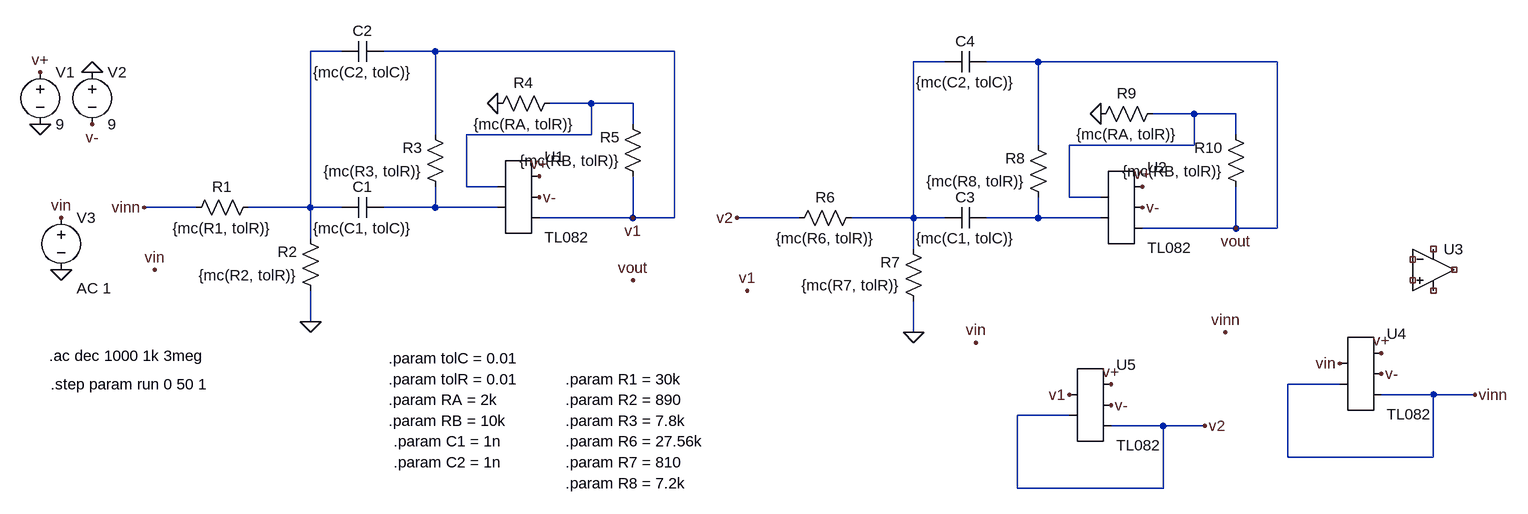
[diagram p0: schematic ej22.asc]
ej22.asc, the LTspice schematic file:
Version 4
SHEET 1 2084 680
WIRE 272 -80 224 -80
WIRE 416 -80 336 -80
WIRE 784 -80 416 -80
WIRE 1200 -64 1152 -64
WIRE 1344 -64 1264 -64
WIRE 1712 -64 1344 -64
WIRE 656 0 592 0
WIRE 720 0 656 0
WIRE 1584 16 1520 16
WIRE 1648 16 1584 16
WIRE 720 32 720 0
WIRE 416 48 416 -80
WIRE 656 48 656 0
WIRE 656 48 464 48
WIRE 1648 48 1648 16
WIRE 1344 64 1344 -64
WIRE 1584 64 1584 16
WIRE 1584 64 1392 64
WIRE 464 128 464 48
WIRE 512 128 464 128
WIRE 1392 144 1392 64
WIRE 1440 144 1392 144
WIRE 48 160 -32 160
WIRE 224 160 224 -80
WIRE 224 160 128 160
WIRE 272 160 224 160
WIRE 416 160 416 128
WIRE 416 160 336 160
WIRE 512 160 416 160
WIRE 720 176 720 112
WIRE 720 176 576 176
WIRE 784 176 784 -80
WIRE 784 176 720 176
WIRE 976 176 880 176
WIRE 1152 176 1152 -64
WIRE 1152 176 1056 176
WIRE 1200 176 1152 176
WIRE 1344 176 1344 144
WIRE 1344 176 1264 176
WIRE 1440 176 1344 176
WIRE 1648 192 1648 128
WIRE 1648 192 1504 192
WIRE 1712 192 1712 -64
WIRE 1712 192 1648 192
WIRE 224 208 224 160
WIRE 1152 224 1152 176
WIRE 224 336 224 288
WIRE 1152 352 1152 304
WIRE 1808 432 1728 432
WIRE 1952 448 1872 448
WIRE 2016 448 1952 448
WIRE 1392 480 1312 480
WIRE 1536 496 1456 496
WIRE 1600 496 1536 496
WIRE 1728 544 1728 432
WIRE 1952 544 1952 448
WIRE 1952 544 1728 544
WIRE 1312 592 1312 480
WIRE 1536 592 1536 496
WIRE 1536 592 1312 592
FLAG 224 336 0
FLAG 512 0 0
FLAG 576 112 v+
FLAG 576 144 v-
FLAG -192 -48 v+
FLAG -112 32 v-
FLAG 1152 352 0
FLAG 1440 16 0
FLAG 1504 128 v+
FLAG 1504 160 v-
FLAG 1248 368 vin
FLAG -16 256 vin
FLAG 720 272 vout
FLAG 1648 192 vout
FLAG 720 176 v1
FLAG -160 176 vin
FLAG -192 32 0
FLAG -112 -48 0
FLAG -160 256 0
FLAG 880 176 v2
FLAG 2016 448 vinn
FLAG -32 160 vinn
FLAG 1808 400 vin
FLAG 1632 352 vinn
FLAG 1392 448 v1
FLAG 1872 384 v+
FLAG 1872 416 v-
FLAG 1600 496 v2
FLAG 1456 432 v+
FLAG 1456 464 v-
FLAG 896 288 v1
SYMBOL res 144 144 R90
WINDOW 0 0 56 VBottom 2
WINDOW 3 32 56 VTop 2
SYMATTR InstName R1
SYMATTR Value {mc(R1, tolR)}
SYMBOL res 240 304 R180
WINDOW 0 36 76 Left 2
WINDOW 3 36 40 Left 2
SYMATTR InstName R2
SYMATTR Value {mc(R2, tolR)}
SYMBOL res 432 144 R180
WINDOW 0 36 76 Left 2
WINDOW 3 36 40 Left 2
SYMATTR InstName R3
SYMATTR Value {mc(R3, tolR)}
SYMBOL cap 336 144 R90
WINDOW 0 0 32 VBottom 2
WINDOW 3 32 32 VTop 2
SYMATTR InstName C1
SYMATTR Value {mc(C1, tolC)}
SYMBOL cap 336 -96 R90
WINDOW 0 0 32 VBottom 2
WINDOW 3 32 32 VTop 2
SYMATTR InstName C2
SYMATTR Value {mc(C2, tolC)}
SYMBOL res 608 -16 R90
WINDOW 0 0 56 VBottom 2
WINDOW 3 32 56 VTop 2
SYMATTR InstName R4
SYMATTR Value {mc(RA, tolR)}
SYMBOL res 736 128 R180
WINDOW 0 36 76 Left 2
WINDOW 3 36 40 Left 2
SYMATTR InstName R5
SYMATTR Value {mc(RB, tolR)}
SYMBOL AutoGenerated\\TL082 544 144 R0
SYMATTR InstName U1
SYMBOL res 1072 160 R90
WINDOW 0 0 56 VBottom 2
WINDOW 3 32 56 VTop 2
SYMATTR InstName R6
SYMATTR Value {mc(R6, tolR)}
SYMBOL res 1168 320 R180
WINDOW 0 36 76 Left 2
WINDOW 3 36 40 Left 2
SYMATTR InstName R7
SYMATTR Value {mc(R7, tolR)}
SYMBOL res 1360 160 R180
WINDOW 0 36 76 Left 2
WINDOW 3 36 40 Left 2
SYMATTR InstName R8
SYMATTR Value {mc(R8, tolR)}
SYMBOL cap 1264 160 R90
WINDOW 0 0 32 VBottom 2
WINDOW 3 32 32 VTop 2
SYMATTR InstName C3
SYMATTR Value {mc(C1, tolC)}
SYMBOL cap 1264 -80 R90
WINDOW 0 0 32 VBottom 2
WINDOW 3 32 32 VTop 2
SYMATTR InstName C4
SYMATTR Value {mc(C2, tolC)}
SYMBOL res 1536 0 R90
WINDOW 0 0 56 VBottom 2
WINDOW 3 32 56 VTop 2
SYMATTR InstName R9
SYMATTR Value {mc(RA, tolR)}
SYMBOL res 1664 144 R180
WINDOW 0 36 76 Left 2
WINDOW 3 36 40 Left 2
SYMATTR InstName R10
SYMATTR Value {mc(RB, tolR)}
SYMBOL AutoGenerated\\TL082 1472 160 R0
SYMATTR InstName U2
SYMBOL voltage -192 -64 R0
WINDOW 123 0 0 Left 0
WINDOW 39 0 0 Left 0
SYMATTR InstName V1
SYMATTR Value 9
SYMBOL voltage -112 -64 R0
WINDOW 123 0 0 Left 0
WINDOW 39 0 0 Left 0
SYMATTR InstName V2
SYMATTR Value 9
SYMBOL voltage -160 160 R0
WINDOW 123 24 124 Left 2
WINDOW 39 0 0 Left 0
SYMATTR InstName V3
SYMATTR Value ""
SYMATTR Value2 AC 1
SYMBOL Opamps\\UniversalOpamp2 1952 256 R0
SYMATTR InstName U3
SYMBOL AutoGenerated\\TL082 1840 416 R0
SYMATTR InstName U4
SYMBOL AutoGenerated\\TL082 1424 464 R0
SYMATTR InstName U5
TEXT 344 424 Left 2 !.param tolR = 0.01
TEXT 344 456 Left 2 !.param RA = 2k
TEXT 344 488 Left 2 !.param RB = 10k
TEXT 616 424 Left 2 !.param R1 = 30k
TEXT 616 456 Left 2 !.param R2 = 890
TEXT 352 520 Left 2 !.param C1 = 1n
TEXT 352 552 Left 2 !.param C2 = 1n
TEXT 616 488 Left 2 !.param R3 = 7.8k
TEXT 616 520 Left 2 !.param R6 = 27.56k
TEXT 616 552 Left 2 !.param R7 = 810
TEXT 616 584 Left 2 !.param R8 = 7.2k
TEXT -178 388 Left 2 !.ac dec 1000 1k 3meg
TEXT 344 392 Left 2 !.param tolC = 0.01
TEXT -176 432 Left 2 !.step param run 0 50 1

The netlist it stands for:
* ej22.asc
R1 N001 vinn {mc(R1, tolR)}
R2 0 N001 {mc(R2, tolR)}
R3 N005 v1 {mc(R3, tolR)}
C1 N005 N001 {mc(C1, tolC)}
C2 v1 N001 {mc(C2, tolC)}
R4 N003 0 {mc(RA, tolR)}
R5 v1 N003 {mc(RB, tolR)}
* U1: TL082 (symbol AutoGenerated\TL082 not available, pins judged from their places): pin1=N003 pin2=N005 pin3=v+ pin4=v- pin5=v1
R6 N002 v2 {mc(R6, tolR)}
R7 0 N002 {mc(R7, tolR)}
R8 N006 vout {mc(R8, tolR)}
C3 N006 N002 {mc(C1, tolC)}
C4 vout N002 {mc(C2, tolC)}
R9 N004 0 {mc(RA, tolR)}
R10 vout N004 {mc(RB, tolR)}
* U2: TL082 (symbol AutoGenerated\TL082 not available, pins judged from their places): pin1=N004 pin2=N006 pin3=v+ pin4=v- pin5=vout
V1 v+ 0 9
V2 0 v- 9
V3 vin 0 AC 1
XU3 NC_01 NC_02 NC_03 NC_04 NC_05 level.2 Avol=1Meg GBW=10Meg Slew=10Meg ilimit=25m rail=0 Vos=0 phimargin=45 en=0 enk=0 in=0 ink=0 Rin=500Meg  ; pins IN+ IN- V+ V- OUT
* U4: TL082 (symbol AutoGenerated\TL082 not available, pins judged from their places): pin1=vin pin2=vinn pin3=v+ pin4=v- pin5=vinn
* U5: TL082 (symbol AutoGenerated\TL082 not available, pins judged from their places): pin1=v1 pin2=v2 pin3=v+ pin4=v- pin5=v2
.param tolR = 0.01
.param RA = 2k
.param RB = 10k
.param R1 = 30k
.param R2 = 890
.param C1 = 1n
.param C2 = 1n
.param R3 = 7.8k
.param R6 = 27.56k
.param R7 = 810
.param R8 = 7.2k
.ac dec 1000 1k 3meg
.param tolC = 0.01
.step param run 0 50 1
.lib UniversalOpamps2.sub
.backanno
.end